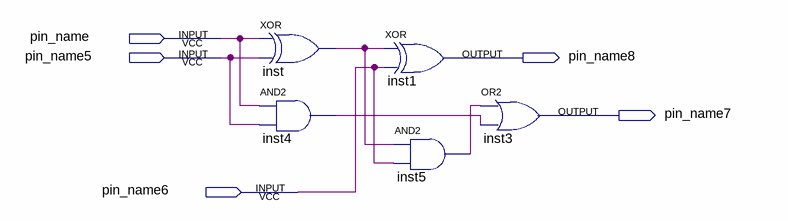
[diagram p0: schematic sheet]
// Quartus schematic test.bdf as structural Verilog: 5 symbols, 5 pins
module test (
  input  pin_name,
  input  pin_name5,
  input  pin_name6,
  output pin_name8,
  output pin_name7
);

  wire inst4_out, inst5_out, inst_out;

  xor inst (inst_out, pin_name, pin_name5);
  and inst4 (inst4_out, pin_name, pin_name5);
  xor inst1 (pin_name8, inst_out, pin_name6);
  and inst5 (inst5_out, inst_out, pin_name6);
  or inst3 (pin_name7, inst5_out, inst4_out);
endmodule
